# Altium schematic sheet Video.SchDoc
size A4; SheetNumber: 6; SheetTotal: 6
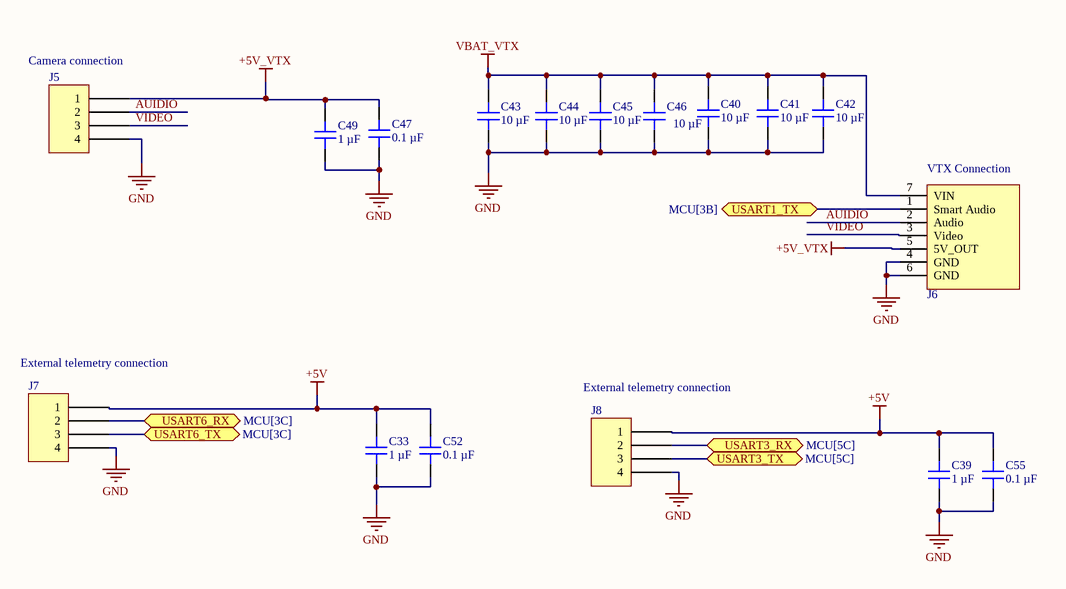
[diagram p0: Video.SchDoc]

## Parts
C33  1 µF  [CAP 0402_1005]
C39  1 µF  [CAP 0402_1005]
C40  10 µF  [MURATA GRM188 0603_1608]
C41  10 µF  [MURATA GRM188 0603_1608]
C42  10 µF  [MURATA GRM188 0603_1608]
C43  10 µF  [MURATA GRM188 0603_1608]
C44  10 µF  [MURATA GRM188 0603_1608]
C45  10 µF  [MURATA GRM188 0603_1608]
C46  10 µF  [MURATA GRM188 0603_1608]
C47  0.1 µF  [CAP 0402_1005]
C49  1 µF  [CAP 0402_1005]
C52  0.1 µF  [CAP 0402_1005]
C55  0.1 µF  [CAP 0402_1005]
J5  DF13A-4P-1.25H(75)  [HIROSE DF13A-4P-1.25H]  (value not drawn)
J6  TBS Unify PRO32 HV 5G8  [TBS Unify Pro 5G8 HV Race]  (value not drawn)
J7  DF13A-4P-1.25H(75)  [HIROSE DF13A-4P-1.25H]  (value not drawn)
J8  DF13A-4P-1.25H(75)  [HIROSE DF13A-4P-1.25H]  (value not drawn)

## Ports
USART1_TX (bidir, see MCU[3B]), USART3_RX (bidir, see MCU[5C]), USART3_TX (bidir, see MCU[5C]), USART6_RX (bidir, see MCU[3C]), USART6_TX (bidir, see MCU[3C])

## Nets
+5V: C33.2 C39.2 C52.2 C55.2 J7.1 J8.1
+5V_VTX: C47.2 C49.2 J5.1 J6.5(5V_OUT)
GND: C33.1 C39.1 C40.1 C41.1 C42.1 C43.1 C44.1 C45.1 C46.1 C47.1 C49.1 C52.1 C55.1 J5.4 J6.4(GND) J6.6(GND) J7.4 J8.4
VBAT_VTX: C40.2 C41.2 C42.2 C43.2 C44.2 C45.2 C46.2 J6.7(VIN)
AUIDIO: J5.2 J6.2(Audio)
USART1_TX: J6.1(Smart_Audio) ; port USART1_TX
USART3_RX: J8.2 ; port USART3_RX
USART3_TX: J8.3 ; port USART3_TX
USART6_RX: J7.2 ; port USART6_RX
USART6_TX: J7.3 ; port USART6_TX
VIDEO: J5.3 J6.3(Video)

## Notes on the sheet
- (near J5) Camera connection
- (near J6) VTX Connection
- (near J7) External telemetry connection
- (near J8) External telemetry connection

## Library data of the parts
C33 C39 C49 = GMC04X7R105K6R3NT: CAP0402 X7R 1UF 10% 6.3V; manufacturer: Cal-Chip Electronics, Inc.; Part Number: GMC04X7R105K6R3NT; Capacitance: 1 µF; Applications: General Purpose; componentlink1description: Datasheet; componentlink1url: https://88ce57.p3cdn1.secureserver.net/wp-content/uploads/2023/01/gmc_series-2.pdf; componentlink2description: DigiKey Link; componentlink2url: https://www.digikey.com/en/products/detail/cal-chip-electronics-inc/GMC04X7R105K6R3NT/18151100; Device Package: 0402 (1005 Metric); lastupdated: 9.02.2024 20:03:58; Lifecycle Status: Active; Minimum Order: 1; Mounting Type: Surface Mount, MLCC; Operating Temperature: -55°C ~ 125°C; Package / Case: 0402 (1005 Metric); packaging: TapeAndReel; partid: 49820; Part Status: Active; price: 0.01; series: GMC; Size / Dimension: 0.039" L x 0.020" W (1.00mm x 0.50mm); Supplier 1: DigiKey; Supplier Part Number 1: 4713-GMC04X7R105K6R3NTCT-ND; Temperature Coefficient: X7R; Thickness (Max): 0.022" (0.55mm); Tolerance: ±10%; value: 1 µF; Voltage - Rated: 6.3V
C40-C46 = GRM188R61E106KA73D: CAP CER 10UF 25V X5R 0603; manufacturer: Murata Electronics; Tolerance: ±10%; Part Number: GRM188R61E106KA73D; Capacitance: 10 µF; Applications: General Purpose; componentlink1description: Datasheet; componentlink1url: https://search.murata.co.jp/Ceramy/image/img/A01X/G101/ENG/GRM188R61E106KA73-01.pdf; componentlink2description: DigiKey Link; componentlink2url: https://www.digikey.com/en/products/detail/murata-electronics/GRM188R61E106KA73D/9867922; Device Package: 0603 (1608 Metric); lastupdated: 20.07.2024 00:23:20; Lifecycle Status: Active; Minimum Order: 1; Mounting Type: Surface Mount, MLCC; Operating Temperature: -55°C ~ 85°C; Package / Case: 0603 (1608 Metric); packaging: TapeAndReel; partid: 12669; Part Status: Active; price: 0.04; series: GRM; Size / Dimension: 0.063" L x 0.031" W (1.60mm x 0.80mm); Supplier 1: DigiKey; Supplier Part Number 1: 490-18214-1-ND; Temperature Coefficient: X5R; Thickness (Max): 0.039" (1.00mm); value: 10 µF; Voltage - Rated: 25V
C47 C52 C55 = CC0402MRX5R5BB104: CAP CER 0.1UF 6.3V X5R 0402; manufacturer: Yageo; Tolerance: ±20%; Part Number: CC0402MRX5R5BB104; Capacitance: 0.1 µF; Applications: General Purpose; componentlink1description: Datasheet; componentlink1url: https://www.yageo.com/upload/media/product/productsearch/datasheet/mlcc/UPY-GPHC_X5R_4V-to-50V_25.pdf; componentlink2description: DigiKey Link; componentlink2url: https://www.digikey.com/en/products/detail/yageo/CC0402MRX5R5BB104/5883384; Device Package: 0402 (1005 Metric); lastupdated: 9.02.2024 20:04:37; Lifecycle Status: Active; Minimum Order: 10; Mounting Type: Surface Mount, MLCC; Operating Temperature: -55°C ~ 85°C; Package / Case: 0402 (1005 Metric); packaging: CutTape; partid: 1960; Part Status: Active; price: 0.01; series: CC; Size / Dimension: 0.039" L x 0.020" W (1.00mm x 0.50mm); Supplier 1: DigiKey; Supplier Part Number 1: 311-3818-1-ND; Temperature Coefficient: X5R; Thickness (Max): 0.022" (0.55mm); value: 0.1 µF; Voltage - Rated: 6.3V
J5 J7 J8 = SM04B-SRSS-TB(LF)(SN): CONN HEADER SMD R/A 4POS 1MM; Manufacturer: JST Sales America Inc.; Current Rating (Amps): 0.7A; Material Flammability Rating: UL94 V-0; Number of Positions: 4; Number of Positions Loaded: All; Pitch - Mating: 0.039" (1.00mm); Shrouding: Shrouded - 4 Wall; Style: Board to Cable/Wire; Voltage Rating: 50V; Part Number: SM04B-SRSS-TB(LF)(SN); ComponentLink1Description: Datasheet; ComponentLink1URL: http://www.jst-mfg.com/product/pdf/eng/eSH.pdf; ComponentLink2Description: DigiKey Link; ComponentLink2URL: http://digikey.com/product-detail/en/jst-sales-america-inc/SM04B-SRSS-TB-LF-SN/455-1804-1-ND/926875; Connector Type: Header; Contact Finish - Mating: Tin; Contact Finish - Post: Tin; Contact Material: Copper Alloy; Contact Shape: Square; Contact Type: Male Pin; Fastening Type: Push-Pull; Features: Solder Retention; Insulation Color: Natural; Insulation Height: 0.114" (2.90mm); Insulation Material: Polyamide (PA), Nylon; LastUpdated: 12.01.2020 23:41:52; Lifecycle Status: Active; Minimum Order: 1; Mounting Type: Surface Mount, Right Angle; Number of Rows: 1; Operating Temperature: -25°C ~ 85°C; Packaging: TapeAndReel; PartId: 62; Part Status: Active; Price: 0.26; Series: SR; Supplier 1: DigiKey; Supplier Part Number 1: 455-1804-1-ND; Termination: Solder
J6 = TBS Unify PRO32 HV 5G8: Video transmitter